# EAGLE schematic Schaltplan_MC_V3 (EAGLE 9.6.2)
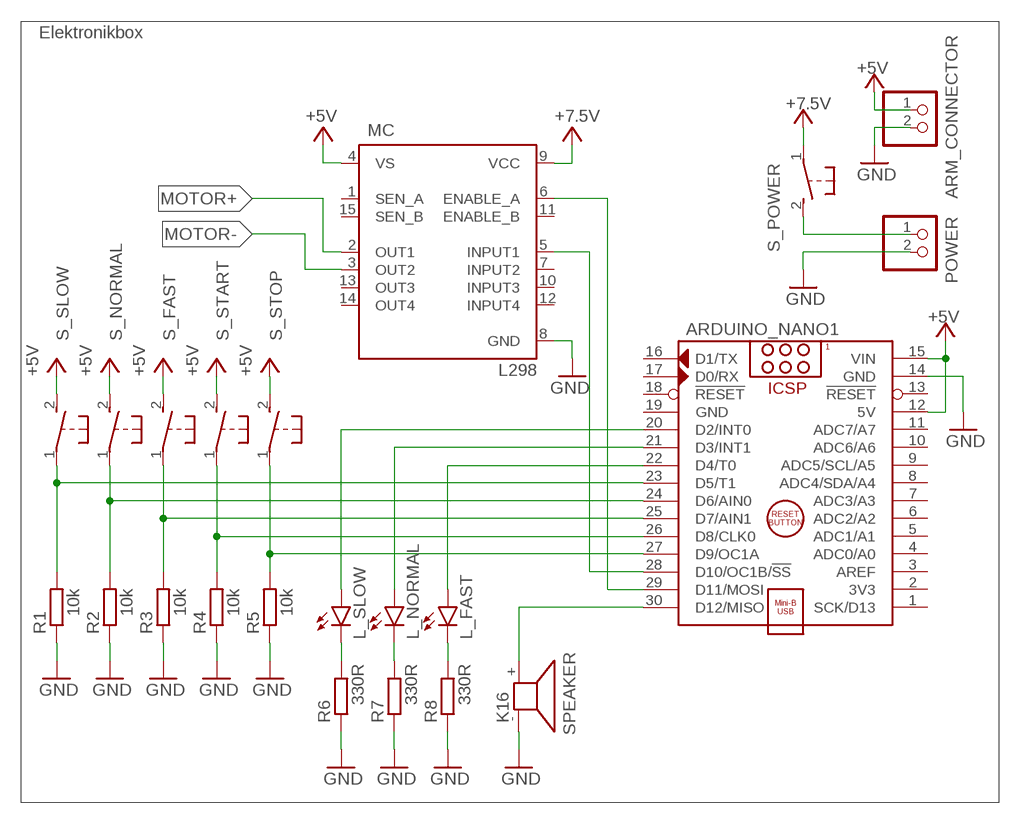
[diagram p0: schematic, sheet 1]

## Parts
ARDUINO_NANO1  ARDUINO_NANO  [ARDUINO_NANO]
ARM_CONNECTOR  PINHD-1X2  [1X02]
L_FAST  LAP4-BOTTOM  [P47F-BOTTOM]
L_NORMAL  LAP4-BOTTOM  [P47F-BOTTOM]
L_SLOW  LAP4-BOTTOM  [P47F-BOTTOM]
MC  L298  [MULTIWATT-15]
POWER  PINHD-1X2  [1X02]
R1  10k  R-EU_0204/5  [0204/5]
R2  10k  R-EU_0204/5  [0204/5]
R3  10k  R-EU_0204/5  [0204/5]
R4  10k  R-EU_0204/5  [0204/5]
R5  10k  R-EU_0204/5  [0204/5]
R6  330R  R-EU_0204/5  [0204/5]
R7  330R  R-EU_0204/5  [0204/5]
R8  330R  R-EU_0204/5  [0204/5]
S_FAST  31-XX  [B3F-31XX]
S_NORMAL  31-XX  [B3F-31XX]
S_POWER  31-XX  [B3F-31XX]
S_SLOW  31-XX  [B3F-31XX]
S_START  31-XX  [B3F-31XX]
S_STOP  31-XX  [B3F-31XX]
SPEAKER  K16  AL11P  [AL11P]

## Nets
+5V: ARDUINO_NANO1.12(5V) ARDUINO_NANO1.15(VIN) ARM_CONNECTOR.1 MC.4(VS) MC.9(VCC) S_FAST.2(S) S_NORMAL.2(S) S_POWER.1(P) S_SLOW.2(S) S_START.2(S) S_STOP.2(S) ; supply symbol labelled +7.5V
GND: ARDUINO_NANO1.14(GND) ARM_CONNECTOR.2 MC.8(GND) POWER.2 R1.1 R2.1 R3.1 R4.1 R5.1 R6.2 R7.2 R8.2 SPEAKER.-
L_SLOW: L_SLOW.C R6.1
MOTOR+: MC.2(OUT1)
MOTOR-: MC.3(OUT2)
N$1: ARDUINO_NANO1.29(D11/MOSI) MC.6(ENABLE_A)
N$2: ARDUINO_NANO1.28(D10/OC1B/!SS) MC.5(INPUT1)
N$3: ARDUINO_NANO1.23(D5/T1) R1.2 S_SLOW.1(P)
N$4: ARDUINO_NANO1.24(D6/AIN0) R2.2 S_NORMAL.1(P)
N$5: ARDUINO_NANO1.25(D7/AIN1) R3.2 S_FAST.1(P)
N$6: ARDUINO_NANO1.26(D8/CLK0) R4.2 S_START.1(P)
N$7: ARDUINO_NANO1.27(D9/OC1A) R5.2 S_STOP.1(P)
N$8: POWER.1 S_POWER.2(S)
N$9: ARDUINO_NANO1.22(D4/T0) L_FAST.A
N$10: L_NORMAL.C R7.1
N$13: ARDUINO_NANO1.30(D12/MISO) SPEAKER.+
N$14: ARDUINO_NANO1.21(D3/INT1) L_NORMAL.A
N$16: L_FAST.C R8.1
N$17: ARDUINO_NANO1.20(D2/INT0) L_SLOW.A
Unconnected: ARDUINO_NANO1.1(SCK/D13) ARDUINO_NANO1.2(3V3) ARDUINO_NANO1.3(AREF) ARDUINO_NANO1.4(ADC0/A0) ARDUINO_NANO1.5(ADC1/A1) ARDUINO_NANO1.6(ADC2/A2) ARDUINO_NANO1.7(ADC3/A3) ARDUINO_NANO1.8(ADC4/SDA/A4) ARDUINO_NANO1.9(ADC5/SCL/A5) ARDUINO_NANO1.10(ADC6/A6) ARDUINO_NANO1.11(ADC7/A7) ARDUINO_NANO1.13(!RESET) ARDUINO_NANO1.16(D1/TX) ARDUINO_NANO1.17(D0/RX) ARDUINO_NANO1.18(!RESET) MC.1(SEN_A) MC.7(INPUT2) MC.10(INPUT3) MC.11(ENABLE_B) MC.12(INPUT4) MC.13(OUT3) MC.14(OUT4) MC.15(SEN_B)

## Notes on the sheet
- Elektronikbox

## Power pins joined to a net without a drawn wire
GND: ARDUINO_NANO1.19(GND)

## Library data of the parts
ARDUINO_NANO1 = ArduinoNanoV30:ARDUINO_NANO: Arduino Nano V3.0 Module Overview: The Arduino Nano is a small, complete, and breadboard-friendly board based on the ATmega328 (Arduino Nano 3.x) or ATmega168 (Arduino Nano 2.x). It has more or less the same functionality of the Arduino Duemilanove, but in a different package. It lacks only a DC power jack, and works with a Mini-B USB cable instead of a standard one. The Nano was designed and is being produced by Gravitech <http://www.gravitech.us/arna30wiatp.html>. General specifications: Item Value Microcontroller Atmel ATmega168 or ATmega328 Operating Voltage (logic level) 5 V Input Voltage (recommended) 7-12 V Input Voltage (limits) 6-20 V Digital I/O Pins 14 (of which 6 provide PWM output) Analog Input Pins 8 DC Current per I/O Pin 40 mA Flash Memory 16 KB (ATmega168) or 32 KB (ATmega328) of which 2 KB used by bootloader SRAM 1 KB (ATmega168) or 2 KB (ATmega328) EEPROM 512 bytes (ATmega168) or 1 KB (ATmega328) Clock Speed 16 MHz Dimensions (Inches) 0.73" x 1.70" Dimensions (mm) 18mm x 45mm Overall height About 9 mm (not including pins) Weigth 5 g Power: The Arduino Nano can be powered via the Mini-B USB connection, 6-20V unregulated external power supply (pin 30), or 5V regulated external power supply (pin 27). The power source is automatically selected to the highest voltage source. Memory: The ATmega168 has 16 KB of flash memory for storing code (of which 2 KB is used for the bootloader); the ATmega328 has 32 KB, (also with 2 KB used for the bootloader). The ATmega168 has 1 KB of SRAM and 512 bytes of EEPROM (which can be read and written with the EEPROM library); the ATmega328 has 2 KB of SRAM and 1 KB of EEPROM. Input and Output: Each of the 14 digital pins on the Nano can be used as an input or output, using pinMode(), digitalWrite(), and digitalRead() functions. They operate at 5 volts. Each pin can provide or receive a maximum of 40 mA and has an internal pull-up resistor (disconnected by default) of 20-50 kOhms. In addition, some pins have specialized functions. Visit Arduino - ArduinoBoardNano <https://www.arduino.cc/en/Main/ArduinoBoardNano>
ARM_CONNECTOR POWER = pinhead:PINHD-1X2: PIN HEADER
L_FAST L_NORMAL L_SLOW = led:*P4: PointLED® Enhanced Thinfilm LED TOP & BOTTOM mount LS P47F, LR P47F, LA P47F, LY P47F, LT P4SG, LB P4SG, LW P4SG Source: http://catalog.osram-os.com .. LA_LR_LS_LY_P47F_Pb_free.pdf
MC = st-microelectronics_L289N:L298: DUAL FULL-BRIDGE DRIVER; MPN: L298N; OC_FARNELL: 1589425; OC_NEWARK: 32M1527
R1-R8 = rcl:R-EU_: RESISTOR, European symbol; SPICEPREFIX: R
S_FAST S_NORMAL S_POWER S_SLOW S_START S_STOP = switch-omron:31-XX: OMRON SWITCH; MPN: B3F-3100; OC_FARNELL: 959704; OC_NEWARK: 36M3582
SPEAKER = buzzer:AL11P: SPEAKER Source: Buerklin; OC_FARNELL: unknown; OC_NEWARK: unknown